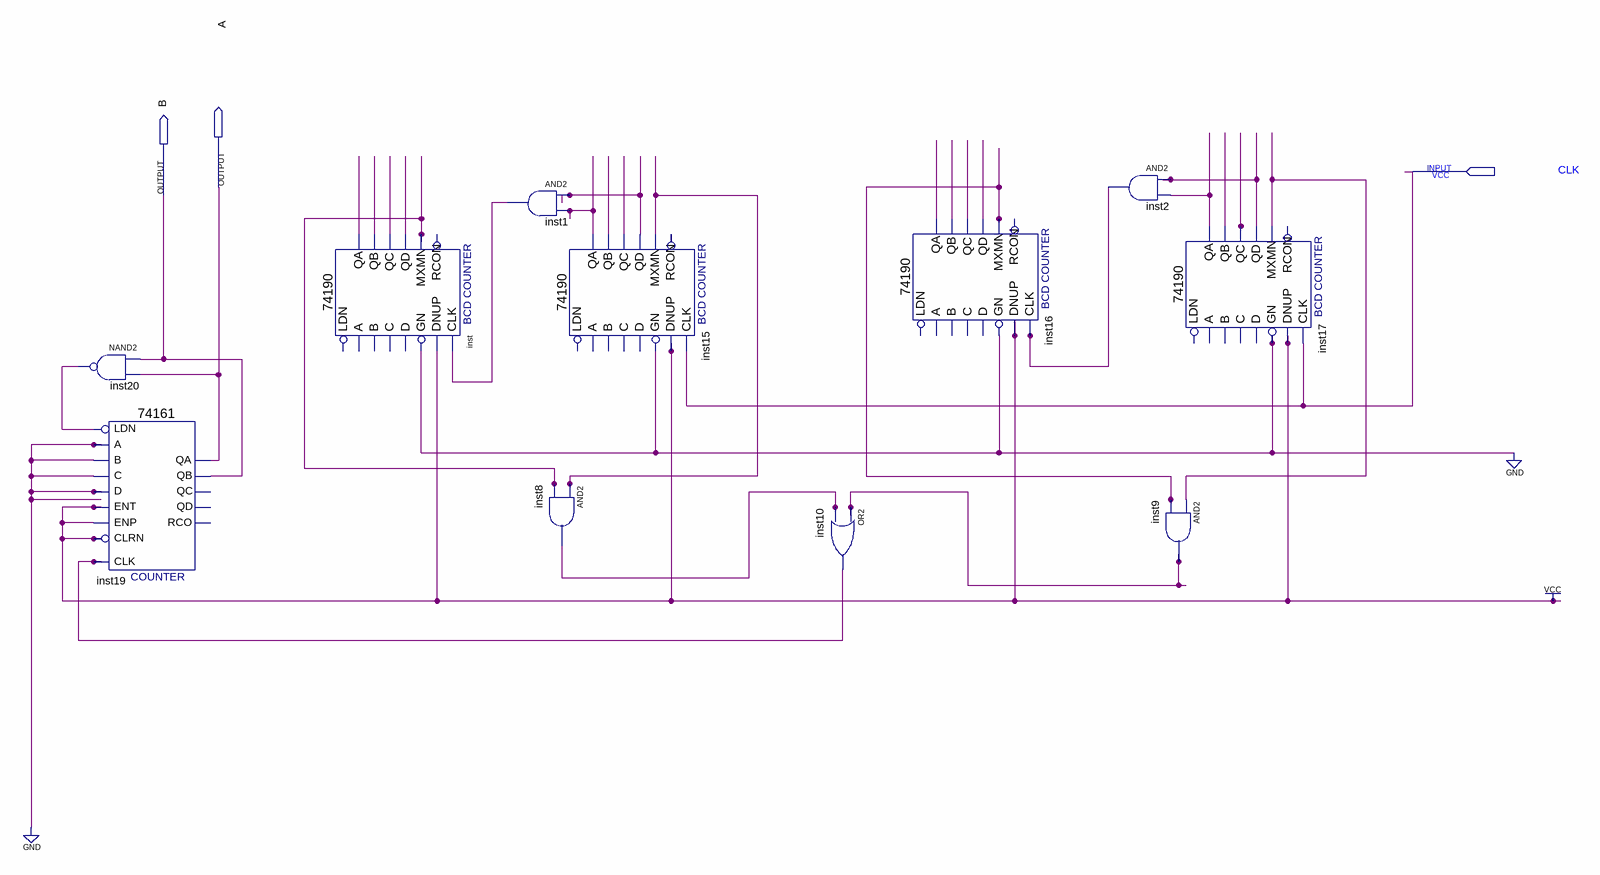
[diagram p0: schematic sheet]
// Quartus schematic Cross.bdf as structural Verilog: 11 symbols, 3 pins
module Cross (
  input  CLK,
  output A,
  output B
);

  wire inst1_out, inst2_out, inst8_out, inst9_out, inst10_out, inst15_mxmn, inst15_qa, inst15_qb, inst15_qc,
       inst15_qd, inst15_rcon, inst16_mxmn, inst16_qa, inst16_qb, inst16_qc, inst16_qd, inst17_mxmn,
       inst17_qa, inst17_qb, inst17_qc, inst17_qd, inst17_rcon, inst20_out, inst_mxmn, inst_qa, inst_qb,
       inst_qc, inst_qd;

  nand inst20 (inst20_out, B, A);
  \74161  inst19 (
    .CLRN(1'b1), .CLK(inst10_out), .ENP(1'b1), .LDN(inst20_out), .A(1'b0), .D(1'b0), .ENT(1'b1), .B(1'b0),
    .C(1'b0), .QB(B), .QA(A));  // open: QD, QC, RCO
  \74190  inst (
    .GN(1'b0), .CLK(inst1_out), .DNUP(1'b1), .QA(inst_qa), .QB(inst_qb), .QD(inst_qd), .QC(inst_qc),
    .MXMN(inst_mxmn));  // open: LDN, A, C, B, D, RCON
  and inst1 (inst1_out, inst15_qd, inst15_qa);
  \74190  inst15 (
    .GN(1'b0), .CLK(CLK), .DNUP(1'b1), .QA(inst15_qa), .QB(inst15_qb), .QD(inst15_qd), .QC(inst15_qc),
    .MXMN(inst15_mxmn), .RCON(inst15_rcon));  // open: LDN, A, C, B, D
  and inst8 (inst8_out, inst15_mxmn, inst_mxmn);
  or inst10 (inst10_out, inst9_out, inst8_out);
  \74190  inst16 (
    .GN(1'b0), .CLK(inst2_out), .DNUP(1'b1), .QA(inst16_qa), .QB(inst16_qb), .QD(inst16_qd), .QC(inst16_qc),
    .MXMN(inst16_mxmn));  // open: LDN, A, C, B, D, RCON
  and inst2 (inst2_out, inst17_qd, inst17_qa);
  \74190  inst17 (
    .GN(1'b0), .CLK(CLK), .DNUP(1'b1), .QA(inst17_qa), .QB(inst17_qb), .QD(inst17_qd), .QC(inst17_qc),
    .MXMN(inst17_mxmn), .RCON(inst17_rcon));  // open: LDN, A, C, B, D
  and inst9 (inst9_out, inst17_mxmn, inst16_mxmn);
endmodule
